# Altium schematic sheet Ethernet.SchDoc
size A4; SheetNumber: 3; SheetTotal: 5
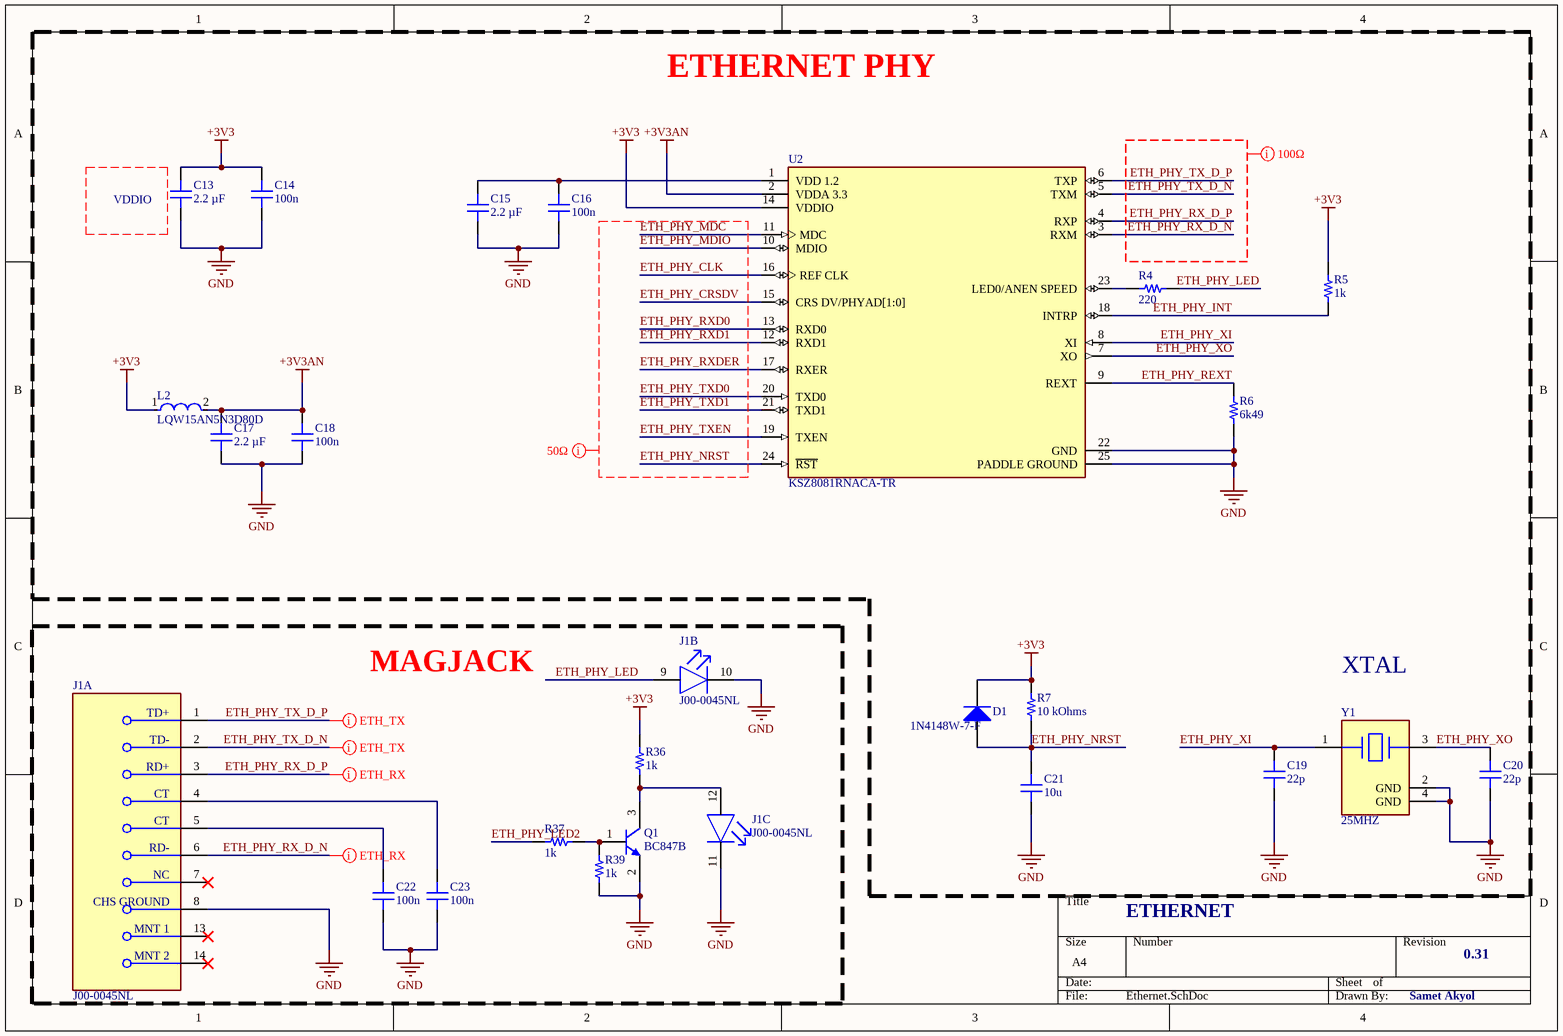
[diagram p0: Ethernet.SchDoc]

## Parts
C13  2.2 µF  [CAP 0402_1005]
C14  100n  [CAP 0402_1005]
C15  2.2 µF  [CAP 0402_1005]
C16  100n  [CAP 0402_1005]
C17  2.2 µF  [CAP 0402_1005]
C18  100n  [CAP 0402_1005]
C19  22p  [CAP 0402_1005]
C20  22p  [CAP 0402_1005]
C21  10u  [CAP 0402_1005]
C22  100n  [CAP 0402_1005]
C23  100n  [CAP 0402_1005]
D1  1N4148W-7-F  [DIOD-SOD123-2_V]
J1  J00-0045NL  [FP-J00-0045NL-MFG]  (parts A,B,C of 3)
L2  LQW15AN5N3D80D  [FP-LQW15AN_80-MFG]
Q1  BC847B  [INF-SOT23_M]
R4  220  [RES 0402_1005]
R5  1k  [RES 0402_1005]
R6  6k49  [RES 0402_1005]
R7  10 kOhms  [RES 0402_1005]
R36  1k  [RES 0402_1005]
R37  1k  [RES 0402_1005]
R39  1k  [RES 0402_1005]
U2  KSZ8081RNACA-TR  [FP-QFN44-24LD-PL-1-MFG]
Y1  25MHZ  [FP-ABM8G-MFG]

## Blocks framed on the sheet
ETHERNET PHY: C13-C21 D1 L2 R4-R7 U2 Y1
MAGJACK: C22 C23 J1 Q1 R36 R37 R39

## Nets
+3V3: C13.2 C14.2 D1.2(K) L2.1 R5.2 R7.2 R36.1 U2.14(VDDIO)
+3V3AN: C17.2 C18.2 L2.2 U2.2(VDDA_3.3)
GND: C13.1 C14.1 C15.1 C16.1 C17.1 C18.1 C19.1 C20.1 C21.1 C22.1 C23.1 J1.8(CHS_GROUND) J1.10(GREEN_C) J1.11(YELLOW_CATHODE) Q1.2(E) R6.1 R39.1 U2.22(GND) U2.25(PADDLE_GROUND) Y1.2(GND) Y1.4(GND)
ETH_PHY_CLK: U2.16(REF_CLK)
ETH_PHY_CRSDV: U2.15(CRS_DV/PHYAD[1:0])
ETH_PHY_INT: R5.1 U2.18(INTRP)
ETH_PHY_LED: J1.9(GREEN_A) R4.1
ETH_PHY_LED2: R37.2
ETH_PHY_MDC: U2.11(MDC)
ETH_PHY_MDIO: U2.10(MDIO)
ETH_PHY_NRST: C21.2 D1.1(A) R7.1 U2.24(~{RST})
ETH_PHY_REXT: R6.2 U2.9(REXT)
ETH_PHY_RX_D_N: J1.6(RD-) U2.3(RXM)
ETH_PHY_RX_D_P: J1.3(RD+) U2.4(RXP)
ETH_PHY_RXD0: U2.13(RXD0)
ETH_PHY_RXD1: U2.12(RXD1)
ETH_PHY_RXDER: U2.17(RXER)
ETH_PHY_TX_D_N: J1.2(TD-) U2.5(TXM)
ETH_PHY_TX_D_P: J1.1(TD+) U2.6(TXP)
ETH_PHY_TXD0: U2.20(TXD0)
ETH_PHY_TXD1: U2.21(TXD1)
ETH_PHY_TXEN: U2.19(TXEN)
ETH_PHY_XI: C19.2 U2.8(XI) Y1.1
ETH_PHY_XO: C20.2 U2.7(XO) Y1.3
NetC15_2: C15.2 C16.2 U2.1(VDD_1.2)
NetC22_2: C22.2 J1.5(CT)
NetC23_2: C23.2 J1.4(CT)
NetJ1_12: J1.12(YELLOW_ANODE) Q1.3(C) R36.2
NetQ1_1: Q1.1(B) R37.1 R39.2
NetR4_2: R4.2 U2.23(LED0/ANEN_SPEED)

Not connected (* = marked no-connect by the designer): J1 7(NC)* 13(MNT_1)* 14(MNT_2)*

## Layout directives
mark named 100Ω: ETH_PHY_RX_D_N, ETH_PHY_RX_D_P, ETH_PHY_TX_D_N, ETH_PHY_TX_D_P
differential pair: ETH_PHY_RX_D_N, ETH_PHY_RX_D_P, ETH_PHY_TX_D_N, ETH_PHY_TX_D_P
mark named 50Ω: ETH_PHY_CLK, ETH_PHY_CRSDV, ETH_PHY_MDC, ETH_PHY_MDIO, ETH_PHY_NRST, ETH_PHY_RXD0, ETH_PHY_RXD1, ETH_PHY_RXDER, ETH_PHY_TXD0, ETH_PHY_TXD1, ETH_PHY_TXEN

## Notes on the sheet
- (near C13) VDDIO
- XTAL
- ETHERNET
- 0.31
- Samet Akyol

## Library data of the parts
C13 C15 C17 = CL05A225KO5NQNC: CAP CER 2.2UF 16V X5R 0402; manufacturer: Samsung Electro-Mechanics; Tolerance: ±10%; Part Number: CL05A225KO5NQNC; Value: 2.2 µF; Applications: General Purpose; Capacitance: 2.2 µF; componentlink1description: Datasheet; componentlink1url: http://www.samsungsem.com/kr/support/product-search/mlcc/CL05A225KO5NQNC.jsp; componentlink2description: DigiKey Link; componentlink2url: https://www.digikey.com/en/products/detail/samsung-electro-mechanics/CL05A225KO5NQNC/3887119; Device Package: 0402 (1005 Metric); lastupdated: 9.02.2024 20:04:38; Lifecycle Status: Active; Minimum Order: 1; Mounting Type: Surface Mount, MLCC; Operating Temperature: -55°C ~ 85°C; Package / Case: 0402 (1005 Metric); packaging: TapeAndReel; partid: 1761; Part Status: Active; price: 0.03; series: CL; Size / Dimension: 0.039" L x 0.020" W (1.00mm x 0.50mm); Supplier 1: DigiKey; Supplier Part Number 1: 1276-1461-1-ND; Temperature Coefficient: X5R; Thickness (Max): 0.022" (0.55mm); Voltage - Rated: 16V
C14 C16 C18-C20 C22 C23 = CL05B104KP5VPNC: CAP CER 100NF 10V X7R 0402; manufacturer: Samsung Electro-Mechanics; Capacitance: 0.1 µF; Tolerance: ±10%; Part Number: CL05B104KP5VPNC; Applications: Automotive; componentlink1description: Datasheet; componentlink1url: https://mm.digikey.com/Volume0/opasdata/d220001/medias/docus/5458/CL05B104KP5VPNC_Spec.pdf; componentlink2description: DigiKey Link; componentlink2url: https://www.digikey.com/en/products/detail/samsung-electro-mechanics/CL05B104KP5VPNC/20498482; Device Package: 0402 (1005 Metric); lastupdated: 9.02.2024 20:03:17; Lifecycle Status: Active; Minimum Order: 1; Mounting Type: Surface Mount, MLCC; Operating Temperature: -55°C ~ 125°C; Package / Case: 0402 (1005 Metric); packaging: TapeAndReel; partid: 56690; price: 0.01; Ratings: AEC-Q200; series: CL; Size / Dimension: 0.039" L x 0.020" W (1.00mm x 0.50mm); Supplier 1: DigiKey; Supplier Part Number 1: 1276-CL05B104KP5VPNCCT-ND; Temperature Coefficient: X7R; Thickness (Max): 0.022" (0.55mm); Voltage - Rated: 10V
  C14 C16 C18 C22 C23: Value: 100n
  C19 C20: Value: 22p
C21 = CL05A225KO5NQNC: CAP CER 2.2UF 16V X5R 0402; manufacturer: Samsung Electro-Mechanics; Capacitance: 2.2 µF; Tolerance: ±10%; Part Number: CL05A225KO5NQNC; Value: 10u; Applications: General Purpose; componentlink1description: Datasheet; componentlink1url: http://www.samsungsem.com/kr/support/product-search/mlcc/CL05A225KO5NQNC.jsp; componentlink2description: DigiKey Link; componentlink2url: https://www.digikey.com/en/products/detail/samsung-electro-mechanics/CL05A225KO5NQNC/3887119; Device Package: 0402 (1005 Metric); lastupdated: 9.02.2024 20:04:38; Lifecycle Status: Active; Minimum Order: 1; Mounting Type: Surface Mount, MLCC; Operating Temperature: -55°C ~ 85°C; Package / Case: 0402 (1005 Metric); packaging: TapeAndReel; partid: 1761; Part Status: Active; price: 0.03; series: CL; Size / Dimension: 0.039" L x 0.020" W (1.00mm x 0.50mm); Supplier 1: DigiKey; Supplier Part Number 1: 1276-1461-1-ND; Temperature Coefficient: X5R; Thickness (Max): 0.022" (0.55mm); Voltage - Rated: 16V
D1 = CMP-2000-04932-2: Fast Switching Diode, 100 V, 0.15 A, -65 to 150 degC, 2-Pin?SOD123, RoHS, Tape and Reel; Recovery Time: 4ns; Brand: DiodesIncorporated; Unit Weight: 0.000353oz; Max Surge Current: 2A; Peak Reverse Voltage: 100V; Ir - Reverse Current: 1uA; Vf - Forward Voltage: 1.25V; Configuration: Single; If - Forward Current: 0.15A; Product Category: Diodes-GeneralPurpose,Power,Switching; Operating Temperature Range: -65Cto+150C; Packaging: Reel; Manufacturer URL: http://www.diodes.com/; Maximum Operating Temperature: +150C; Height: 1.25mm; Minimum Operating Temperature: -65C; Product: SwitchingDiodes; Package URL: http://www.diodes.com/datasheets/ds18004.pdf; Type: SwitchingDiode; Package Reference: SOD123-2; Width: 1.7mm; Datasheet URL: http://www.farnell.com/datasheets/1915529.pdf; Datasheet Version: Rev. 24-2, 10/2013; Series: 1N4148; Factory Pack Quantity: 3000; Length: 2.85mm; RoHS: True; Manufacturer: DiodesIncorporated; Mounting Style: SMD/SMT; Package / Case: SOD-123
J1 = CMP-16436-000005-1: CONN JACK 1PORT 100 BASE-TX PCB; Number of Cores per Jack: 4; Gender: Female; Connector Type: RJ45; Number of Positions Loaded: 8; Current Rating: 8mA; Pitch: 2.54mm; Shielding: Shielded; Direction: Down; Number of Ports: 1; Depth: 21.59mm; Radiation Hardening: No; Contact Material: Bronze; Contact Plating: Gold; Mount: Through Hole; Max Operating Temperature: 70°C; Packaging: Rail/Tube; Color: Green; Number of Contacts: 8; Lead Free: Lead Free; Series: STARJACK™ J00; Package Quantity: 30; Length: 16.26mm; Number of Rows: 1; Min Operating Temperature: 0°C; Termination: Solder; Orientation: Right Angle; Housing Material: Thermoplastic
L2 = CMP-06042-007060-1: Wire Wound RF Inductor 5.3nH ±0.5nH 1770mA 0.04Ω 0402 (1005); Max DC Current: 1.77A; Test Frequency: 100MHz; Q Factor: 35; Shielding: Unshielded; Self Resonant Frequency: 8GHz; Core Material: Non-Magnetic; DC Resistance (DCR): 40mR; Case/Package: 0402; Height - Seated (Max): 0.024inch; Height: 0.5mm; Mount: Surface Mount; Inductance: 5.3nH; Width: 0.5mm; Package Quantity: 1; Packaging: Tape and Reel; Current Rating: 1.77A; Case Code (Metric): 1005; Length: 0.039inch; Case Code (Imperial): 0402; Resistor Type: Wirewound; Max Operating Temperature: 125°C; Termination: SMD/SMT; Min Operating Temperature: -55°C
Q1 = CMP-1177-00042-1: NPN Silicon AF Transistor, 45 V VCEO, 100 mA IC, SOT23, Reel, Green; Manufacturer: Infineon; VEBO (max): 6Â V; ICBO (max): 15Â nA; VCBO (max): 50Â V; IBM (max): 200Â mA; Green: TRUE; Ptot (max): 330Â mW; fT (typ): 250Â MHz; IC (max): 100Â mA; VCEO (max): 45Â V; PackageDescription: 3-Pin Small Outline Transistor Package, 1.3 x 2.9 mm Body, 0.95 mm Pitch; ComponentLink3URL: http://www.infineon.com/dgdl/SOT23-Package_Overview.pdf?folderId=db3a30431936bc4b0119532290053c66&fileId=db3a30431936bc4b0119533468123c85; PackageVersion: Apr-08; Packing: Reel; ComponentLink3Description: Package Specification; ComponentLink2URL: http://www.infineon.com/dgdl/bc847series_bc848series_bc849series_bc850series.pdf?folderId=db3a304314dca389011541d30fa21656&fileId=db3a304314dca389011541d4630a1657; ComponentLink1URL: http://www.infineon.com/; ComponentLink2Description: Datasheet; Polarity: NPN; Mounting Technology: Surface Mount; PackageReference: SOT23; ICM (max): 200Â mA; ComponentLink1Description: Manufacturer URL; PartNumber: BC847B
R4-R6 R36 R37 R39 = CPF0402B1K0E: RES SMD 1K OHM 0.1% 1/16W 0402; Manufacturer: TE Connectivity Passive Product; Power (Watts): 0.063W, 1/16W; Resistance: 1 kOhms; Temperature Coefficient: ±25ppm/°C; Part Number: CPF0402B1K0E; ComponentLink1Description: Datasheet; ComponentLink1URL: https://www.te.com/commerce/DocumentDelivery/DDEController?Action=srchrtrv&DocNm=1773200&DocType=DS&DocLang=English; ComponentLink2Description: DigiKey Link; ComponentLink2URL: https://www.digikey.com/en/products/detail/te-connectivity-passive-product/CPF0402B1K0E/4966468; Composition: Thin Film; Device Package: 0402 (1005 Metric); Height - Seated (Max): 0.014" (0.35mm); LastUpdated: 9.02.2024 20:30:24; Lifecycle Status: Active; Minimum Order: 1; Number of Terminations: 2; Operating Temperature: -55°C ~ 155°C; Package / Case: 0402 (1005 Metric); Packaging: TapeAndReel; PartId: 2470; Part Status: Active; Price: 0.10; Series: CPF, Neohm; Size / Dimension: 0.039" L x 0.020" W (1.00mm x 0.50mm); Supplier 1: DigiKey; Supplier Part Number 1: A119928CT-ND; Supplier Device Package: 0402; Tolerance: ±0.1%
  R4: Value: 220
  R5 R36 R37 R39: Value: 1k
  R6: Value: 6k49
R7 = RP73PF1E10KBTD: RES 10K OHM 0.1% 1/10W 0402; Manufacturer: TE Connectivity Passive Product; Power (Watts): 0.1W, 1/10W; Temperature Coefficient: ±25ppm/°C; Part Number: RP73PF1E10KBTD; Value: 10 kOhms; ComponentLink1Description: Datasheet; ComponentLink1URL: https://www.te.com/commerce/DocumentDelivery/DDEController?Action=srchrtrv&DocNm=1773272&DocType=DS&DocLang=English; ComponentLink2Description: DigiKey Link; ComponentLink2URL: https://www.digikey.com/en/products/detail/te-connectivity-passive-product/RP73PF1E10KBTD/8260957; Composition: Thin Film; Device Package: 0402 (1005 Metric); Height - Seated (Max): 0.014" (0.35mm); LastUpdated: 9.02.2024 20:30:24; Lifecycle Status: Active; Minimum Order: 1; Number of Terminations: 2; Operating Temperature: -55°C ~ 155°C; Package / Case: 0402 (1005 Metric); Packaging: TapeAndReel; PartId: 2434; Part Status: Active; Price: 0.08; Resistance: 10 kOhms; Series: RP73, Holsworthy; Size / Dimension: 0.039" L x 0.020" W (1.00mm x 0.50mm); Supplier 1: DigiKey; Supplier Part Number 1: A127415CT-ND; Supplier Device Package: 0402; Tolerance: ±0.1%
U2 = CMP-2000-06521-2: IC TRANSCEIVER FULL 1/1 24QFN; Manufacturer: Microchip; Interface: Ethernet,Other; Number Of Channels: 1; Data Rate: 100Mbits/s; Standoff Height: 0.02mm; Min Supply Voltage: 1.71V; Simplex Duplex: Full Duplex; Max Junction Temp: +125°C; Nominal Supply Current: 20-47mA; Max Supply Voltage: 3.465V; Lead Free: Yes; Ambient Temperature Range Low: 0°C; RoHS: TRUE; Ambient Temperature Range High: +70°C; Device Class L2: Interface ICs; Device Class L3: Ethernet Interface ICs; Temperature Range High: +125°C; ComponentLink2Description: Datasheet; Height: 0.9mm; ComponentLink2URL: http://ww1.microchip.com/downloads/en/DeviceDoc/KSZ8081RNA-RND-10BASE-T-100BASE-TX-PHY-with-RMII-Support-DS00002199B.pdf; Automotive: No; Digikey Description: IC TRANSCEIVER FULL 1/1 24QFN; Package: QFN44-24LD-PL-1; Manufacturer Part Number: KSZ8081RNACA-TR; Device Class L1: Integrated Circuits (ICs); Mouser Description: Ethernet ICs 10/100 PHY,  0.11u; Category: IC; Octopart: https://octopart.com/ksz8081rnaca-tr-microchip-66799960; Ipc Land Pattern Name: QFN50P400X400X85-24; Temperature: to +125°C
Y1 = CMP-2000-05733-3: Crystal 25MHz ±20ppm (Tol) ±30ppm (Stability) 18pF FUND 60Ω 4-Pin SMD T/R; Series Resistance: 60R; Length: 3.2mm; Depth: 2.5mm; Packaging: Tape and Reel; Min Operating Temperature: -40°C; Operating Frequency: 25 MHz; Lead Free: Lead Free; Number of Pins: 4; Frequency Tolerance: 20ppm; Radiation Hardening: No; Max Operating Temperature: 85°C; Termination: SMD/SMT; Frequency Stability: 30ppm; Frequency: 25MHz; Series: ABM8G; Mount: Surface Mount; Package Quantity: 1000; Height: 0.039inch; Width: 0.098inch; Case/Package: CSMD; ESR (Equivalent Series Resistance): 60R; Load Capacitance: 18pF; Tolerance: 20ppm